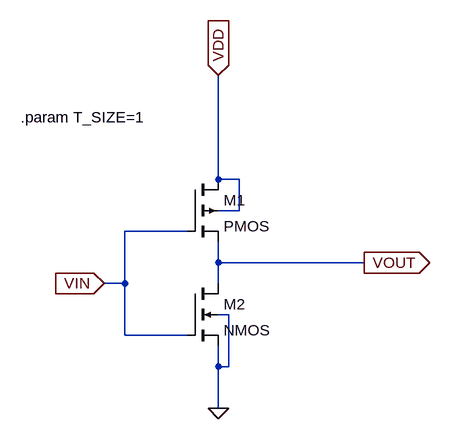
[diagram p0: schematic not.asc]
not.asc, the LTspice schematic file:
Version 4
SHEET 1 1176 868
WIRE 240 240 240 80
WIRE 272 240 240 240
WIRE 272 288 272 240
WIRE 272 288 240 288
WIRE 192 320 96 320
WIRE 240 368 240 336
WIRE 464 368 240 368
WIRE 96 400 96 320
WIRE 96 400 64 400
WIRE 240 400 240 368
WIRE 256 448 240 448
WIRE 96 480 96 400
WIRE 192 480 96 480
WIRE 240 528 240 496
WIRE 256 528 256 448
WIRE 256 528 240 528
WIRE 240 592 240 528
FLAG 64 400 VIN
IOPIN 64 400 In
FLAG 240 80 VDD
IOPIN 240 80 In
FLAG 464 368 VOUT
IOPIN 464 368 Out
FLAG 240 592 0
SYMBOL nmos4 192 400 R0
SYMATTR InstName M2
SYMATTR Value2 l=90n w='{T_SIZE}*200n'
SYMBOL pmos4 192 240 R0
SYMATTR InstName M1
SYMATTR Value2 l=90n w='{T_SIZE}*400n'
TEXT -64 144 Left 2 !.param T_SIZE=1

The netlist it stands for:
* not.asc
M2 VOUT VIN 0 0 NMOS l=90n w='{T_SIZE}*200n'
M1 VDD VIN VOUT VDD PMOS l=90n w='{T_SIZE}*400n'
.model NMOS NMOS
.model PMOS PMOS
.lib standard.mos
.param T_SIZE=1
.backanno
.end